# Altium schematic sheet ControlBoard.SchDoc: Control Board
size A4; SheetNumber: 1; SheetTotal: 7
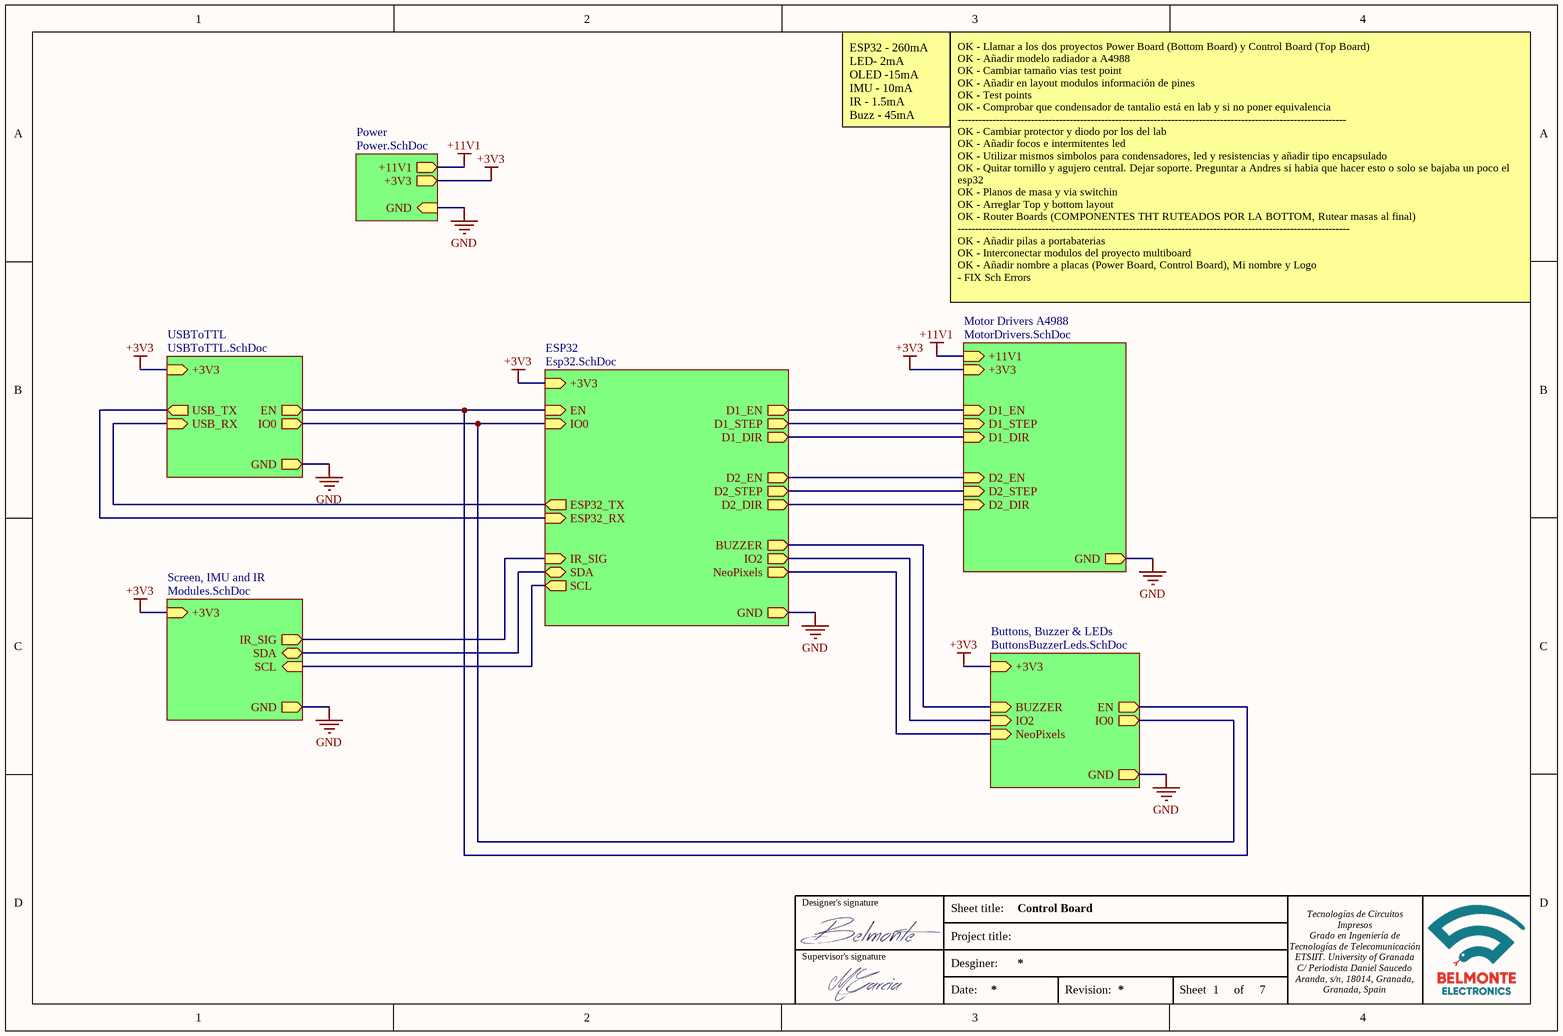
[diagram p0: ControlBoard.SchDoc]

## Sub-sheets
Buttons, Buzzer & LEDs = ButtonsBuzzerLeds.SchDoc: BUZZER (in), +3V3 (in), EN (out), IO2 (in), NeoPixels (in), IO0 (out), GND (out)
ESP32 = Esp32.SchDoc: +3V3 (in), GND (out), EN (in), D2_DIR (out), D2_EN (out), D1_STEP (out), SDA (bidir), D1_DIR (out), D1_EN (out), D2_STEP (out), IO0 (in), ESP32_RX (in), IR_SIG (in), SCL (out), ESP32_TX (out), BUZZER (out), IO2 (out), NeoPixels (out)
Motor Drivers A4988 = MotorDrivers.SchDoc: D1_EN (in), D2_EN (in), D2_STEP (in), +3V3 (in), D1_DIR (in), D2_DIR (in), GND (out), +11V1 (in), D1_STEP (in)
Power = Power.SchDoc: +11V1 (out), +3V3 (out), GND (in)
Screen, IMU and IR = Modules.SchDoc: GND (out), +3V3 (in), IR_SIG (out), SDA (bidir), SCL (in)
USBToTTL = USBToTTL.SchDoc: EN (out), GND (out), USB_RX (in), USB_TX (out), IO0 (out), +3V3 (in)

## Nets
+3V3: sheet ESP32/+3V3, sheet USBToTTL/+3V3, sheet Motor Drivers A4988/+3V3, sheet Power/+3V3, sheet Screen, IMU and IR/+3V3, sheet Buttons, Buzzer & LEDs/+3V3
+11V1: sheet Motor Drivers A4988/+11V1, sheet Power/+11V1
GND: sheet ESP32/GND, sheet USBToTTL/GND, sheet Motor Drivers A4988/GND, sheet Power/GND, sheet Screen, IMU and IR/GND, sheet Buttons, Buzzer & LEDs/GND
(unnamed): sheet ESP32/EN, sheet USBToTTL/EN, sheet Buttons, Buzzer & LEDs/EN
(unnamed): sheet ESP32/D2_DIR, sheet Motor Drivers A4988/D2_DIR
(unnamed): sheet ESP32/D2_EN, sheet Motor Drivers A4988/D2_EN
(unnamed): sheet ESP32/D1_STEP, sheet Motor Drivers A4988/D1_STEP
(unnamed): sheet ESP32/SDA, sheet Screen, IMU and IR/SDA
(unnamed): sheet ESP32/D1_DIR, sheet Motor Drivers A4988/D1_DIR
(unnamed): sheet ESP32/D1_EN, sheet Motor Drivers A4988/D1_EN
(unnamed): sheet ESP32/D2_STEP, sheet Motor Drivers A4988/D2_STEP
(unnamed): sheet ESP32/IO0, sheet USBToTTL/IO0, sheet Buttons, Buzzer & LEDs/IO0
(unnamed): sheet ESP32/ESP32_RX, sheet USBToTTL/USB_TX
(unnamed): sheet ESP32/IR_SIG, sheet Screen, IMU and IR/IR_SIG
(unnamed): sheet ESP32/SCL, sheet Screen, IMU and IR/SCL
(unnamed): sheet ESP32/ESP32_TX, sheet USBToTTL/USB_RX
(unnamed): sheet ESP32/BUZZER, sheet Buttons, Buzzer & LEDs/BUZZER
(unnamed): sheet ESP32/IO2, sheet Buttons, Buzzer & LEDs/IO2
(unnamed): sheet ESP32/NeoPixels, sheet Buttons, Buzzer & LEDs/NeoPixels

## Notes on the sheet
- ESP32 - 260mA
  LED- 2mA
  OLED -15mA
  IMU - 10mA
  IR - 1.5mA
  Buzz - 45mA
- OK - Llamar a los dos proyectos Power Board (Bottom Board) y Control Board (Top Board)
  OK - Añadir modelo radiador a A4988
  OK - Cambiar tamaño vias test point
  OK - Añadir en layout modulos información de pines
  OK - Test points
  OK - Comprobar que condensador de tantalio está en lab y si no poner equivalencia
  ---------------------------------------------------------------------------------------------------------------
  OK - Cambiar protector y diodo por los del lab
  OK - Añadir focos e intermitentes led
  OK - Utilizar mismos simbolos para condensadores, led y resistencias y añadir tipo encapsulado
  OK - Quitar tornillo y agujero central. Dejar soporte. Preguntar a Andres si habia que hacer esto o solo se bajaba un poco el esp32
  OK - Planos de masa y via switchin
  OK - Arreglar Top y bottom layout
  OK - Router Boards (COMPONENTES THT RUTEADOS POR LA BOTTOM, Rutear masas al final)
  ----------------------------------------------------------------------------------------------------------------
  OK - Añadir pilas a portabaterias
  OK - Interconectar modulos del proyecto multiboard
  OK - Añadir nombre a placas (Power Board, Control Board), Mi nombre y Logo
  - FIX Sch Errors
- Designer's signature
- Sheet title:
- Supervisor's signature
- Project title:
- Desginer:
- Date:
- Revision:
- Sheet
- of
- Tecnologías de Circuitos Impresos
  Grado en Ingeniería de Tecnologías de Telecomunicación
  ETSIIT. University of Granada
  C/ Periodista Daniel Saucedo Aranda, s/n, 18014, Granada, Granada, Spain